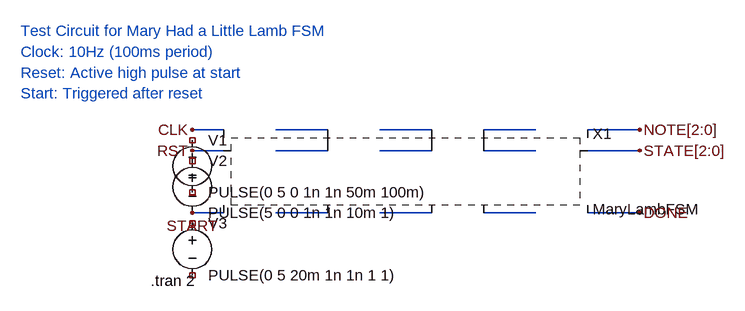
[diagram p0: schematic MaryLambFSMTest.asc]
MaryLambFSMTest.asc, the LTspice schematic file:
Version 4
SHEET 1 1280 680
WIRE 144 96 96 96
WIRE 304 96 224 96
WIRE 464 96 384 96
WIRE 624 96 544 96
WIRE 784 96 704 96
WIRE 144 128 96 128
WIRE 304 128 224 128
WIRE 464 128 384 128
WIRE 624 128 544 128
WIRE 784 128 704 128
WIRE 144 224 96 224
WIRE 304 224 224 224
WIRE 464 224 384 224
WIRE 624 224 544 224
WIRE 784 224 704 224
FLAG 96 96 CLK
FLAG 96 128 RST
FLAG 96 224 START
FLAG 784 96 NOTE[2:0]
FLAG 784 128 STATE[2:0]
FLAG 784 224 DONE
SYMBOL voltage 96 96 R0
WINDOW 123 0 0 Left 0
WINDOW 39 0 0 Left 0
SYMATTR InstName V1
SYMATTR Value PULSE(0 5 0 1n 1n 50m 100m)
SYMBOL voltage 96 128 R0
WINDOW 123 0 0 Left 0
WINDOW 39 0 0 Left 0
SYMATTR InstName V2
SYMATTR Value PULSE(5 0 0 1n 1n 10m 1)
SYMBOL voltage 96 224 R0
WINDOW 123 0 0 Left 0
WINDOW 39 0 0 Left 0
SYMATTR InstName V3
SYMATTR Value PULSE(0 5 20m 1n 1n 1 1)
SYMBOL MaryLambFSM 464 160 R0
SYMATTR InstName X1
TEXT -168 -56 Left 2 ;Test Circuit for Mary Had a Little Lamb FSM
TEXT -168 -24 Left 2 ;Clock: 10Hz (100ms period)
TEXT -168 8 Left 2 ;Reset: Active high pulse at start
TEXT -168 40 Left 2 ;Start: Triggered after reset
TEXT 32 328 Left 2 !.tran 2

The netlist it stands for:
* MaryLambFSMTest.asc
V1 NC_01 NC_02 PULSE(0 5 0 1n 1n 50m 100m)
V2 NC_03 START PULSE(5 0 0 1n 1n 10m 1)
V3 NC_04 NC_05 PULSE(0 5 20m 1n 1n 1 1)
* X1: MaryLambFSM (symbol MaryLambFSM not available, pin order unknown); nets seen at it: CLK, DONE, N001, N002, N003, N004, N005, N006, N007, N008, N009, NOTE[2:0], RST, START, STATE[2:0]
* Test Circuit for Mary Had a Little Lamb FSM
* Clock: 10Hz (100ms period)
* Reset: Active high pulse at start
* Start: Triggered after reset
.tran 2
.backanno
.end